# Altium schematic sheet MCU.SchDoc
size A4; SheetNumber: 2; SheetTotal: 4
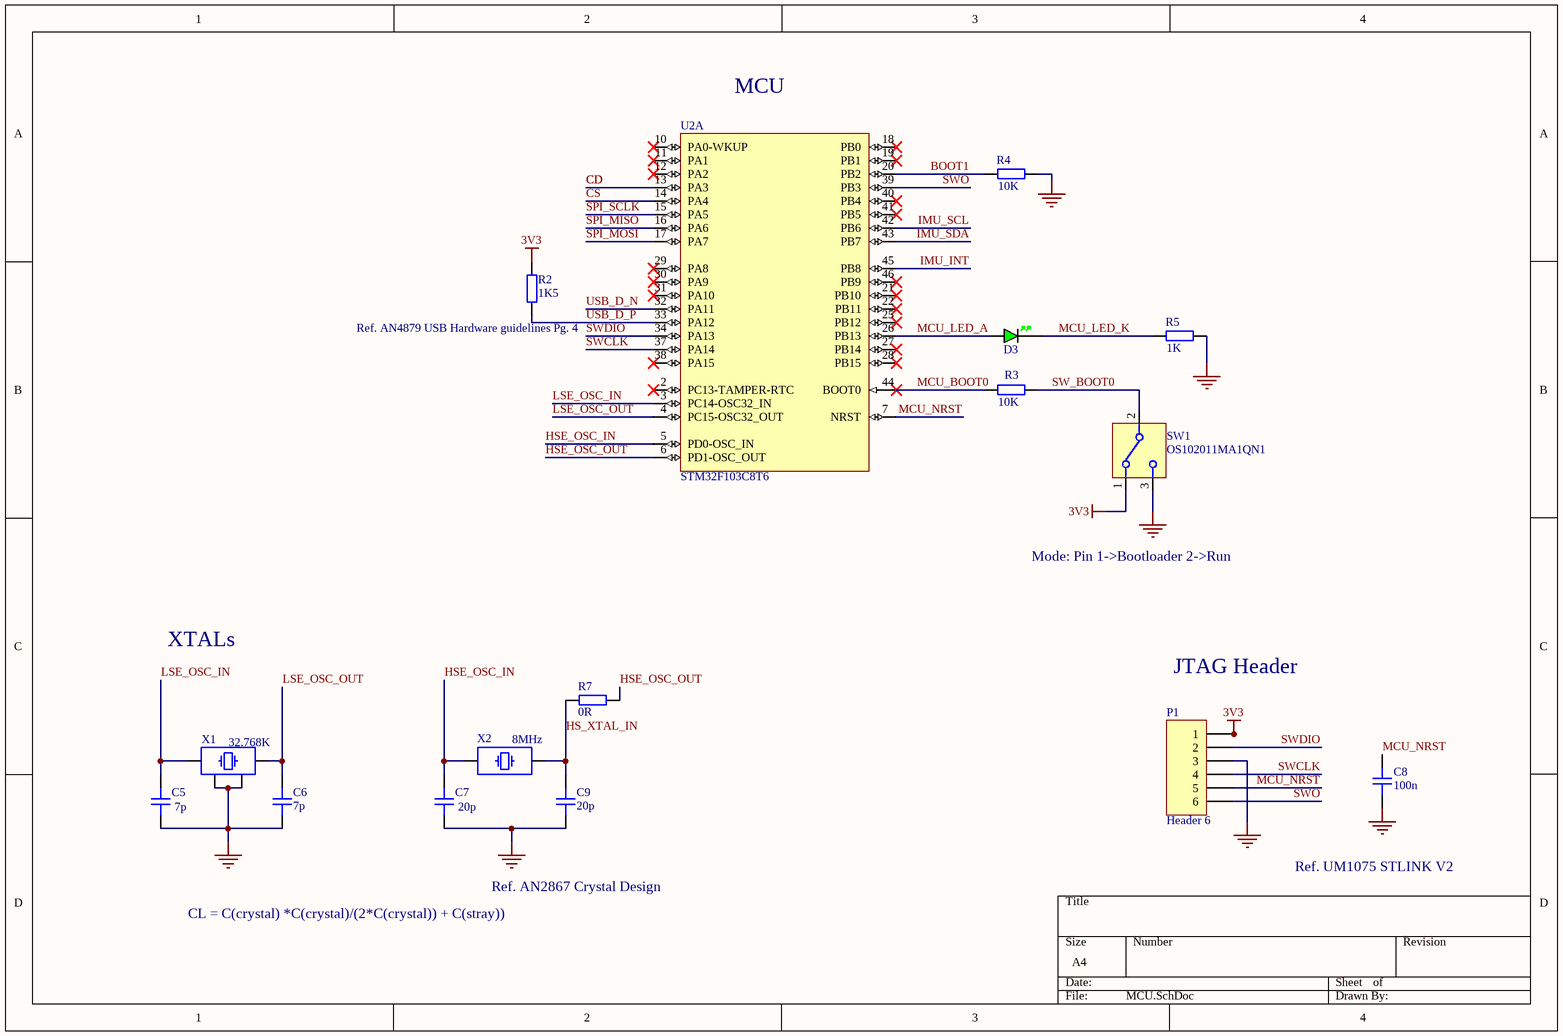
[diagram p0: MCU.SchDoc]

## Parts
C5  7p  [CAP_0402]
C6  7p  [CAP_0402]
C7  20p  [CAP_0402]
C8  100n  [CAP_0402]
C9  20p  [CAP_0402]
D3  GREEN  [LED_0402_GREEN]  (value not drawn)
P1  Header 6  [HDR1X6]
R2  1K5  [RES_0402]
R3  10K  [RES_0402]
R4  10K  [RES_0402]
R5  1K  [RES_0402]
R7  0R  [RES_0402]
SW1  OS102011MA1QN1  [OS102011MA1QN1]
U2  STM32F103C8T6  [STM-LQFP48_L]  (part A of 2)
X1  32.768K  [XTAL_2520]
X2  8MHz  [XTAL_3215-2]

## Nets
3V3: P1.1 R2.1 SW1.1
GND: C5.1 C6.1 C7.1 C8.1 C9.1 P1.3 R4.1 R5.1 SW1.3 X1.2 X1.4
BOOT1: R4.2 U2.20(PB2)
CD: U2.13(PA3)
CS: U2.14(PA4)
HS_XTAL_IN: C9.2 R7.1 X2.2
HSE_OSC_IN: C7.2 U2.5(PD0-OSC_IN) X2.1
HSE_OSC_OUT: R7.2 U2.6(PD1-OSC_OUT)
IMU_INT: U2.45(PB8)
IMU_SCL: U2.42(PB6)
IMU_SDA: U2.43(PB7)
LSE_OSC_IN: C5.2 U2.3(PC14-OSC32_IN) X1.1
LSE_OSC_OUT: C6.2 U2.4(PC15-OSC32_OUT) X1.3
MCU_BOOT0: R3.2 U2.44(BOOT0)
MCU_LED_A: D3.A U2.26(PB13)
MCU_LED_K: D3.K R5.2
MCU_NRST: C8.2 P1.5 U2.7(NRST)
SPI_MISO: U2.16(PA6)
SPI_MOSI: U2.17(PA7)
SPI_SCLK: U2.15(PA5)
SW_BOOT0: R3.1 SW1.2(COM)
SWCLK: P1.4 U2.37(PA14)
SWDIO: P1.2 U2.34(PA13)
SWO: P1.6 U2.39(PB3)
USB_D_N: U2.32(PA11)
USB_D_P: R2.2 U2.33(PA12)

Not connected (* = marked no-connect by the designer): U2 2(PC13-TAMPER-RTC)* 10(PA0-WKUP)* 11(PA1)* 12(PA2)* 18(PB0)* 19(PB1)* 21(PB10)* 22(PB11)* 25(PB12)* 27(PB14)* 28(PB15)* 29(PA8)* 30(PA9)* 31(PA10)* 38(PA15)* 40(PB4)* 41(PB5)* 46(PB9)*

## Notes on the sheet
- (near U2) MCU
- (near R2) Ref. AN4879 USB Hardware guidelines Pg. 4
- Mode: Pin 1->Bootloader 2->Run
- XTALs
- JTAG Header
- CL = C(crystal) *C(crystal)/(2*C(crystal)) + C(stray))
- Ref. AN2867 Crystal Design
- Ref. UM1075 STLINK V2

## Library data of the parts
C5-C9 = CAP_0402: Capacitor SMD 0402; Manufacturer: *; Manufacturer Part Number: *; Distributor Link: *; LCSC: *; Rating: *; Dielectric: *
D3 = LED_0402_GREEN: LED 0402 GREEN SMD
P1 = Header 6: Header, 6-Pin; LatestRevisionDate: 17-Jul-2002; LatestRevisionNote: Re-released for DXP Platform.; Publisher: Altium Limited
R2-R5 R7 = RES_0402: Resistor SMD 0402; Manufacturer: *; Manufacturer Part Number: *; Distributor Link: *; LCSC: *
SW1 = OS102011MA1QN1: Slide Switch SPDT Horizontal THT; Manufacturer: C&K; Manufacturer Part Number: OS102011MA1QN1
U2 = CMP-0237-00215-3: ARM Cortex-M3 32-bit MCU, 64 KB Flash, 20 KB Internal RAM, 37 I/Os, 48-pin LQFP, -40 to 85 degC, Tray; Supply Voltage(Vcc) min (V): 2; Internal RAM Size (kB): 20; FLASH Size (Prog) (kB): 64; A/D Converter: 2x12-bit (10 Channel); I/Os (High Current): 37; Operating Frequency(F) (Processor speed) (MHz): 72; Core: ARM Cortex-M3; ComponentLink3Description: Package Specification; Mounting Technology: Surface Mount; PartNumber: STM32F103C8T6; PackageReference: LQFP48; Packing: Tray; ComponentLink3URL: http://www.st.com/st-web-ui/static/active/en/resource/technical/document/datasheet/DM00058181.pdf; DatasheetVersion: Rev. 16; ComponentLink1URL: http://www.st.com/web/en/home.html; PackageVersion: Rev. 6, 06/2013; ComponentLink2URL: http://www.st.com/st-web-ui/static/active/en/resource/technical/document/datasheet/CD00161566.pdf; ComponentLink1Description: Manufacturer URL; ComponentLink2Description: Datasheet; PackageDescription: 48-Pin Low Profile Quad Flat Package, 7 x 7 mm Body, 0.5 mm Pitch
X1 = XTAL_2520: Crystal SMD 2520; Distributor Link: *
X2 = XTAL_3215: Crystal SMD 3215; Distributor Link: *